# EAGLE design GPS_ant_board (EAGLE 9.3.0)
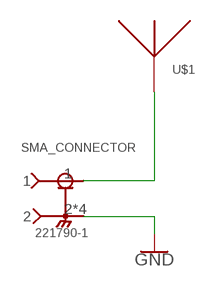
[diagram p0: schematic, sheet 1]

## Parts
SMA_CONNECTOR  221790-1  [TE_221790-1]
U$1  BY-IRIDIUM-254  [BY-IRIDIUM-254]

## Nets
GND: SMA_CONNECTOR.2 SMA_CONNECTOR.3 SMA_CONNECTOR.4 SMA_CONNECTOR.5
N$1: SMA_CONNECTOR.1 U$1.P$1

## Library data of the parts
SMA_CONNECTOR = 221790-1:221790-1: Connector; SMA; PCB; Right Angle; Stainless Steel; 0.6 in.; Beryllium Copper; AVAILABILITY: Unavailable; COMMENT: 221790-1; DESCRIPTION: JACK,RIGHT ANGLE,PCB,SMA; EU_ROHS_COMPLIANCE: Compliant with Exemptions; MF: TE Connectivity; MP: 221790-1; NUMBER_OF_POSITIONS: 1; PACKAGE: None; PRICE: None; TE_PURCHASE_URL: https://www.te.com/usa-en/product-221790-1.html?te_bu=Cor&te_type=disp&te_campaign=seda_glo_cor-seda-global-disp-prtnr-fy19-seda-model-bom-cta_sma-317_1&elqCampaignId=32493
U$1 = iridium-antenna:BY-IRIDIUM-254: Also known as APAE1621R2540ABDD1-T

## Net classes
0 default: clearance 0.065 mm

## Board
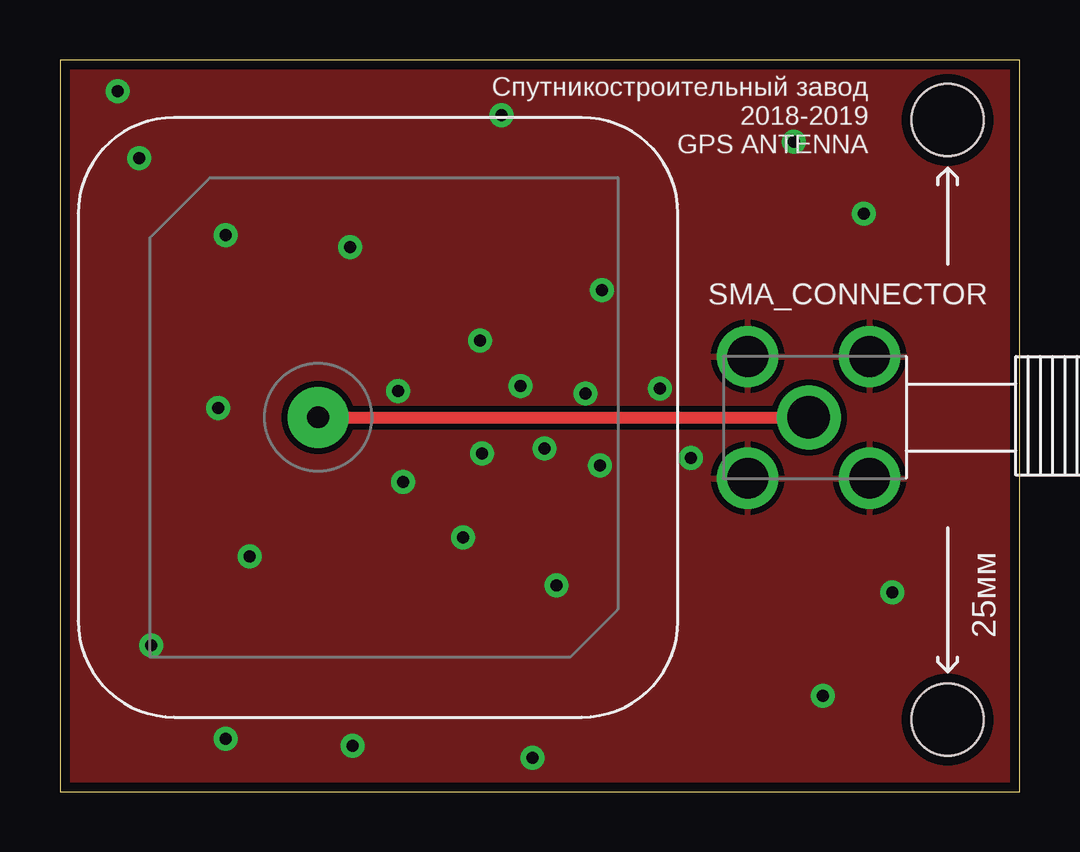
[diagram p1: board, top side]
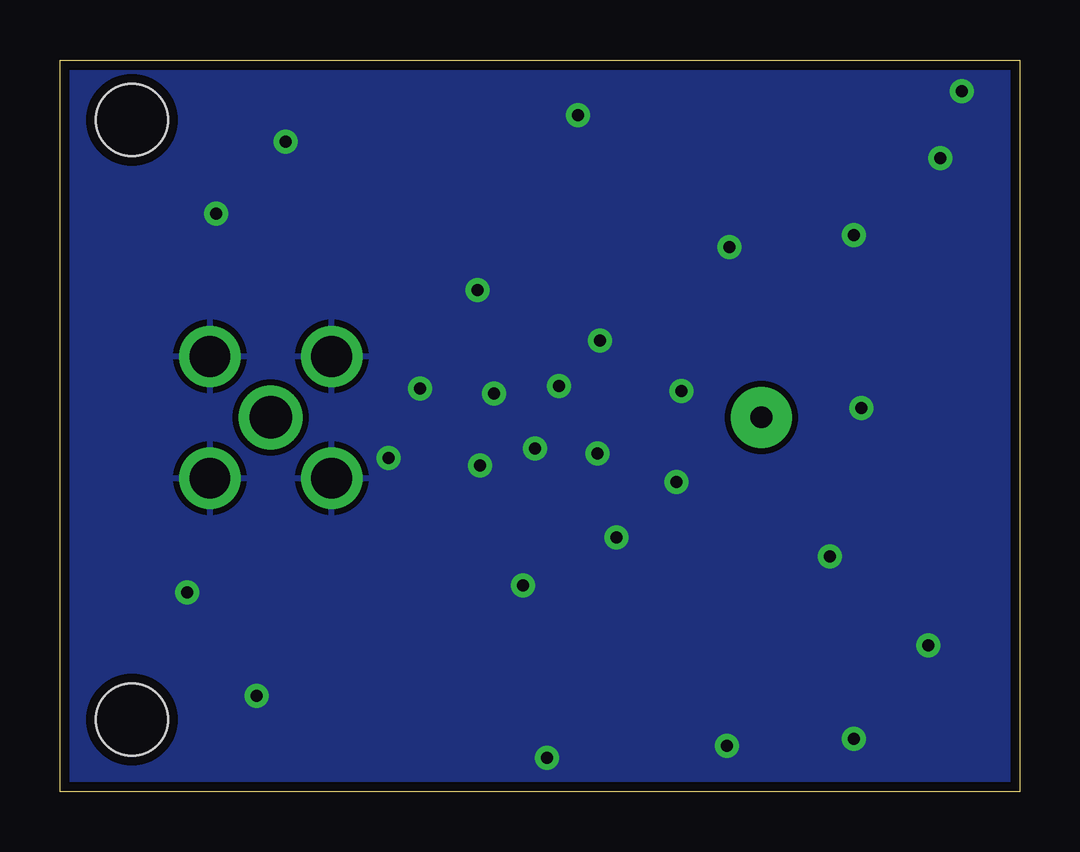
[diagram p2: board, bottom side, seen from below]

Size 40 x 30.5 mm. Coordinates in mm from the lower left corner, seen from the top.
Outline: 0,0 40,0 40,30.5 0,30.5 0,0
Copper layers (1*16): Top 0.035mm / dielectric 1mm / Bottom 0.035mm
Design rules "rezonit": minimum track width 0.2mm, minimum drill 0.5mm, track to track 0.25mm, track to pad 0.25mm, pad to pad 0.25mm, via to via 0.25mm, smd to smd 0.2mm, copper to edge 0.4mm, drill to drill 0.4mm, minimum pad ring 0.25mm, minimum via ring 0.25mm, stop-mask expansion 4mil, vias tented up to drill 0.6mm, thermal gap 10mil
Holes 3 mm at 37,3 37,28

### Footprints (pad centres in the part's own frame; a part is rotated, then mirrored left to right if it is on the bottom)
TE_221790-1 = drill 1.778: 1 0,0 | drill 1.702: 2 -2.54,2.54; 3 2.54,2.54; 4 -2.54,-2.54; 5 2.54,-2.54
BY-IRIDIUM-254 = drill 0.9 pad 2.54: P$1 0,0

### Placement (x,y rotation side)
SMA_CONNECTOR  31.21,15.6 0 top
U$1  10.76,15.6 90 top

### Tracks (layer width: path | path; a pad name or v marks a point on that pad's centre or on a via)
GND  (via drill 0.5)
  other vias: 2.4,29.2 3.3,26.4 18.4,28.2 6.9,23.2 12.1,22.7 17.5,18.8 22.6,20.9 30.6,27.1 33.5,24.1 25,16.8 21.9,16.6 19.2,16.9 14.1,16.7 6.6,16 7.9,9.8 17.6,14.1 20.2,14.3 22.5,13.6 26.3,13.9 14.3,12.9 16.8,10.6 20.7,8.6 34.7,8.3 31.8,4 19.7,1.4 12.2,1.9 6.9,2.2 3.8,6.1
  pour Top: 40,30.5 0,30.5 0,0 40,0
  pour Bottom: 0,30.5 0,0 40,0 40,30.5
N$1
  Top 0.5: U$1.P$1 SMA_CONNECTOR.1

### Text on the board
tPlace: Спутникостроительный завод / 2018-2019 / GPS ANTENNA | 25мм